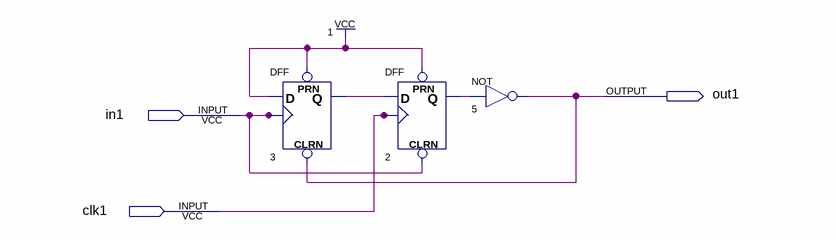
[diagram p0: schematic sheet]
// Quartus schematic oune1f.bdf as structural Verilog: 3 symbols, 3 pins
module oune1f (
  input  in1,
  input  clk1,
  output out1
);

  wire n2_q, n3_q;

  DFF u_3 (.CLRN(out1), .CLK(in1), .D(1'b1), .PRN(1'b1), .Q(n3_q));
  DFF u_2 (.CLRN(in1), .CLK(clk1), .D(n3_q), .PRN(1'b1), .Q(n2_q));
  not u_5 (out1, n2_q);
endmodule
